# Altium schematic sheet LEDmatrix2.SchDoc
size A
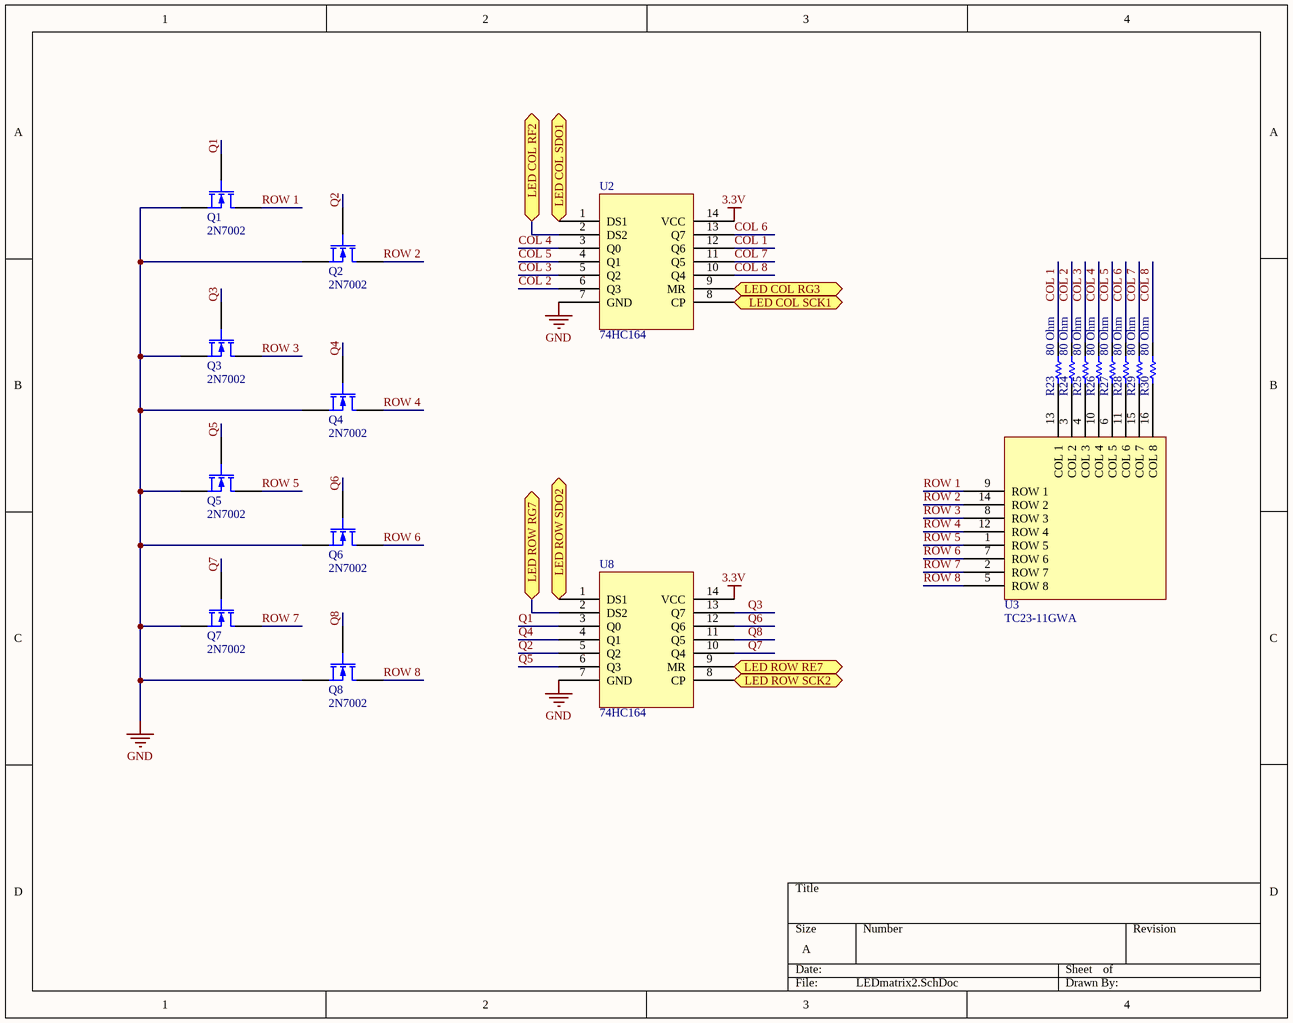
[diagram p0: LEDmatrix2.SchDoc]

## Parts
Q1  2N7002  [Mosfet]
Q2  2N7002  [Mosfet]
Q3  2N7002  [Mosfet]
Q4  2N7002  [Mosfet]
Q5  2N7002  [Mosfet]
Q6  2N7002  [Mosfet]
Q7  2N7002  [Mosfet]
Q8  2N7002  [Mosfet]
R23  80 Ohm  [Resistor0603]
R24  80 Ohm  [Resistor0603]
R25  80 Ohm  [Resistor0603]
R26  80 Ohm  [Resistor0603]
R27  80 Ohm  [Resistor0603]
R28  80 Ohm  [Resistor0603]
R29  80 Ohm  [Resistor0603]
R30  80 Ohm  [Resistor0603]
U2  74HC164  [SHIFT REGISTER]
U3  TC23-11GWA  [LEDPANEL]
U8  74HC164  [SHIFT REGISTER]

## Ports
LED COL RF2, LED COL RG3, LED COL SCK1, LED COL SDO1, LED ROW RE7, LED ROW RG7, LED ROW SCK2, LED ROW SDO2

## Nets
3.3V: U2.14(VCC) U8.14(VCC)
GND: Q1.3(S) Q2.3(S) Q3.3(S) Q4.3(S) Q5.3(S) Q6.3(S) Q7.3(S) Q8.3(S) U2.7(GND) U8.7(GND)
COL 1: R23.2 U2.12(Q6)
COL 2: R24.2 U2.6(Q3)
COL 3: R25.2 U2.5(Q2)
COL 4: R26.2 U2.3(Q0)
COL 5: R27.2 U2.4(Q1)
COL 6: R28.2 U2.13(Q7)
COL 7: R29.2 U2.11(Q5)
COL 8: R30.2 U2.10(Q4)
LED COL RF2: U2.2(DS2) ; port LED COL RF2
LED COL RG3: U2.9(MR) ; port LED COL RG3
LED COL SCK1: U2.8(CP) ; port LED COL SCK1
LED COL SDO1: U2.1(DS1) ; port LED COL SDO1
LED ROW RE7: U8.9(MR) ; port LED ROW RE7
LED ROW RG7: U8.2(DS2) ; port LED ROW RG7
LED ROW SCK2: U8.8(CP) ; port LED ROW SCK2
LED ROW SDO2: U8.1(DS1) ; port LED ROW SDO2
Q1: Q1.2(G) U8.3(Q0)
Q2: Q2.2(G) U8.5(Q2)
Q3: Q3.2(G) U8.13(Q7)
Q4: Q4.2(G) U8.4(Q1)
Q5: Q5.2(G) U8.6(Q3)
Q6: Q6.2(G) U8.12(Q6)
Q7: Q7.2(G) U8.10(Q4)
Q8: Q8.2(G) U8.11(Q5)
ROW 1: Q1.1(D) U3.9(ROW_1)
ROW 2: Q2.1(D) U3.14(ROW_2)
ROW 3: Q3.1(D) U3.8(ROW_3)
ROW 4: Q4.1(D) U3.12(ROW_4)
ROW 5: Q5.1(D) U3.1(ROW_5)
ROW 6: Q6.1(D) U3.7(ROW_6)
ROW 7: Q7.1(D) U3.2(ROW_7)
ROW 8: Q8.1(D) U3.5(ROW_8)
NetR23_1: R23.1 U3.13(COL_1)
NetR24_1: R24.1 U3.3(COL_2)
NetR25_1: R25.1 U3.4(COL_3)
NetR26_1: R26.1 U3.10(COL_4)
NetR27_1: R27.1 U3.6(COL_5)
NetR28_1: R28.1 U3.11(COL_6)
NetR29_1: R29.1 U3.15(COL_7)
NetR30_1: R30.1 U3.16(COL_8)

## Library data of the parts
Q1-Q8 = MOSFET-N: N-Channel MOSFET; Published: 8-Jun-2000; LatestRevisionDate: 17-Jul-2002; LatestRevisionNote: Re-released for DXP Platform.; PackageVersion: 1995/1996; PackageReference: E3; Publisher: Altium Limited; PackageDescription: TO, Flat Index; 3 In-Line, Axial Leads; Body Dia. 4.6mm; Lead Dia. 0.5 mm (max); Farnell Reference: 2775064
R23-R30 = Res1: Resistor; Published: 8-Jun-2000; LatestRevisionDate: 17-Jul-2002; LatestRevisionNote: Re-released for DXP Platform.; PackageReference: AXIAL-0.3; Publisher: Altium Limited; PackageDescription: Axial Device, Thru-Hole; 2 Leads; 0.3 in Pin Spacing; Value: 80 Ohm
U2 U8 = Shift Register: Farnell Reference: 1103161
U3 = LED Dot Matrix: Farnell Reference: 2290396